# EAGLE board Precision Singleboard Charlieplex (EAGLE 6.1), part 1 of 2
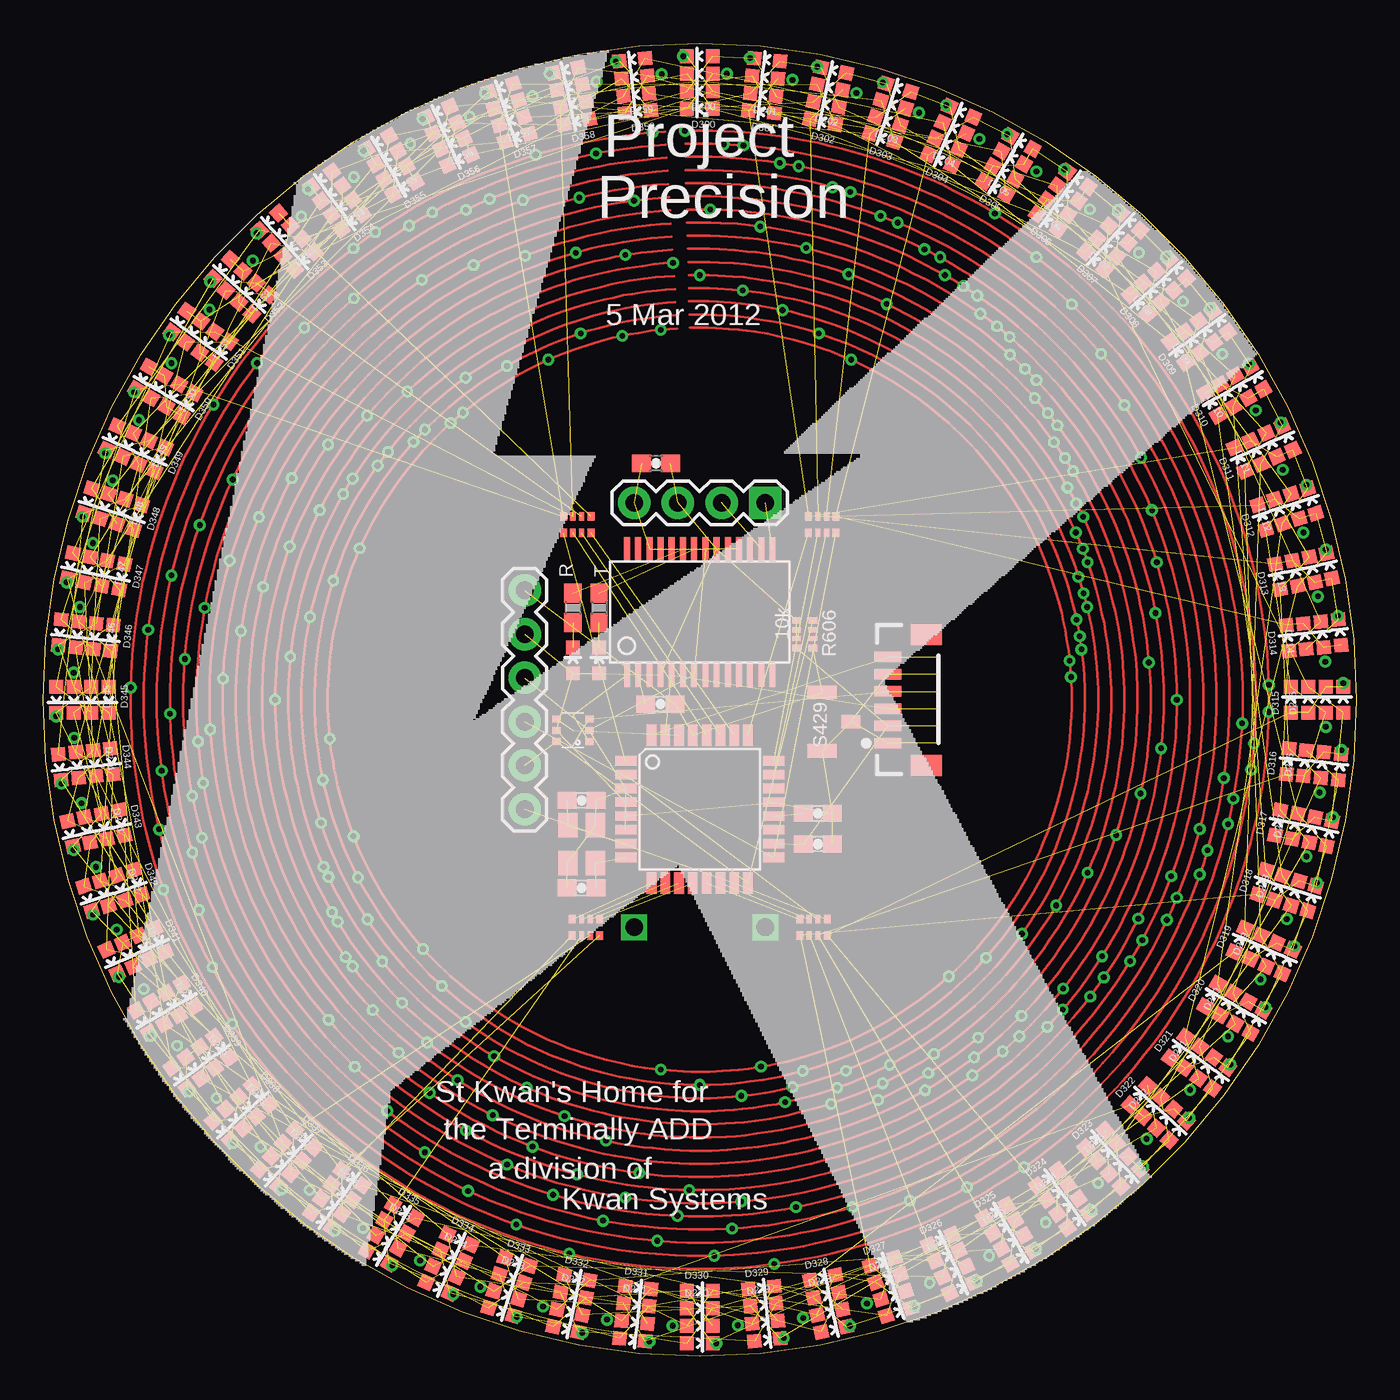
[diagram p2: board, top side]
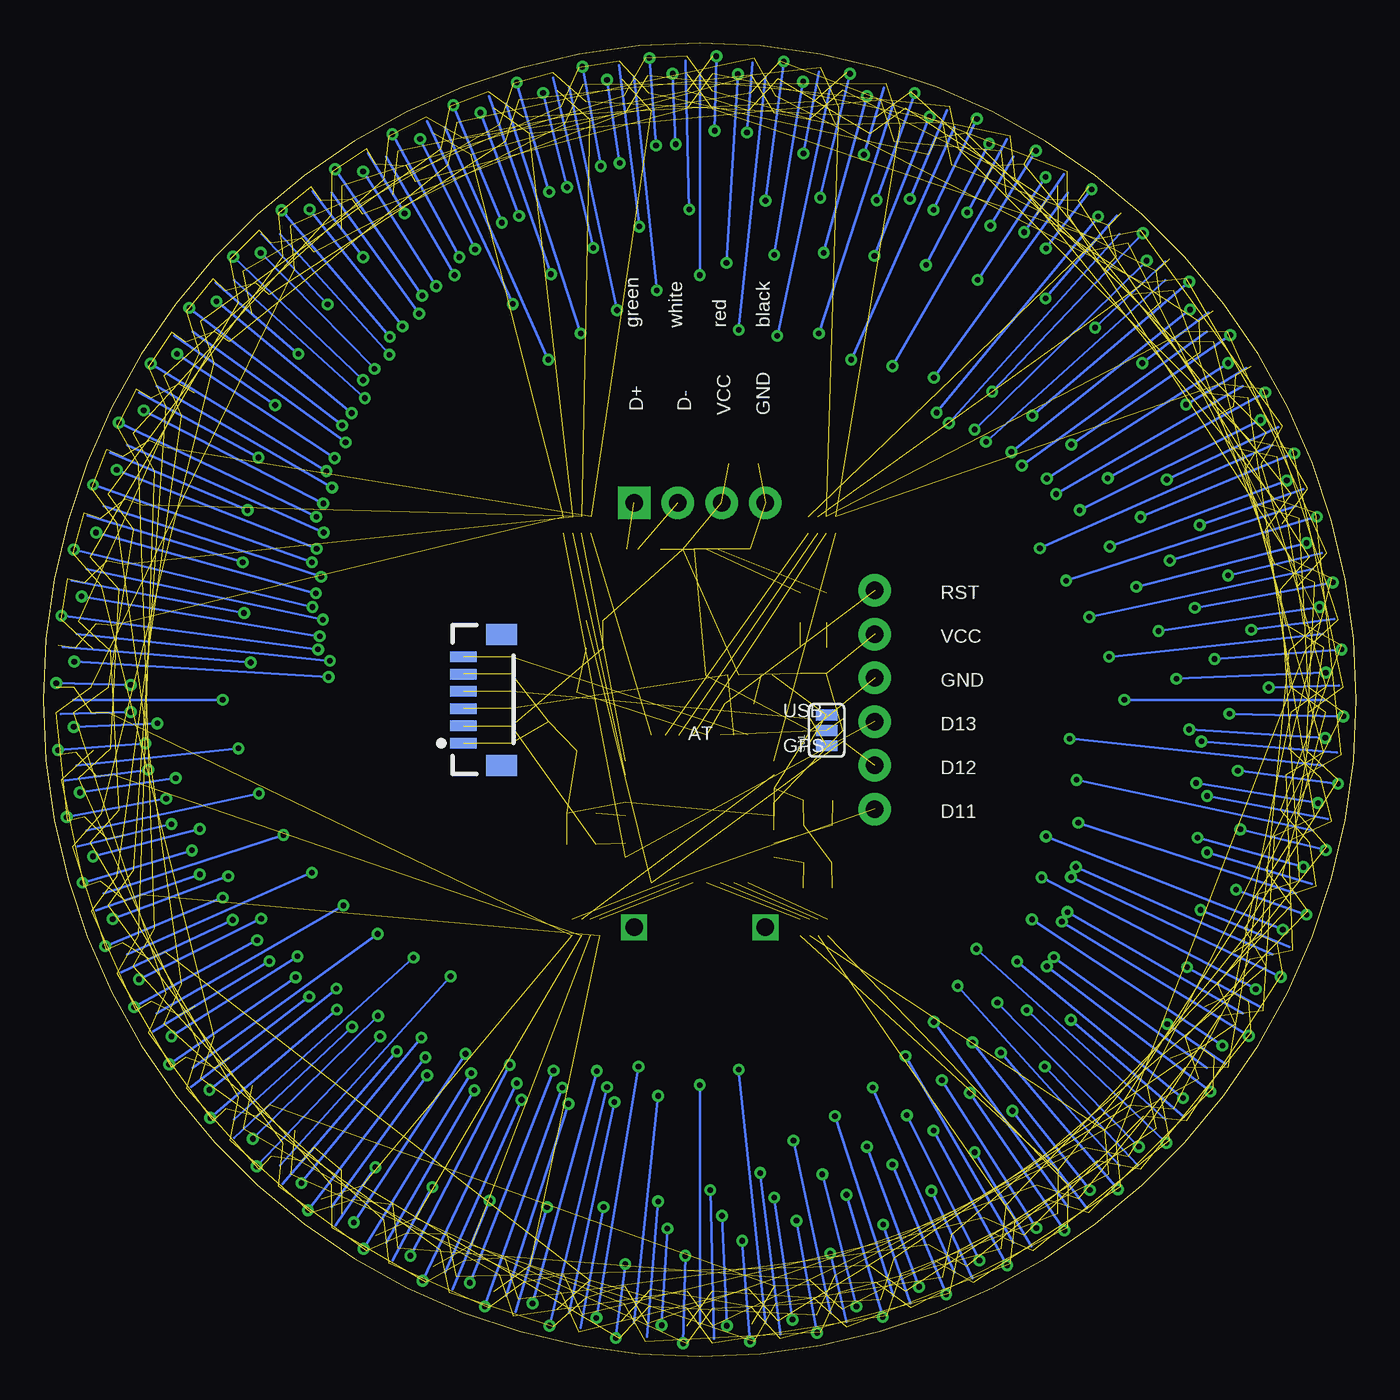
[diagram p3: board, bottom side, seen from below]

Size 76.2 x 76.2 mm. Coordinates in mm from the lower left corner, seen from the top.
Outline: 38.1,76.2 arc-90 76.2,38.1 arc-90 38.1,0 arc-90 0,38.1 arc-90 38.1,76.2
Copper layers (1*16): Top 0.0356mm / dielectric 1.5011mm / Bottom 0.0356mm
Design rules: minimum track width 6mil, minimum drill 13mil, track to track 6mil, track to pad 6mil, pad to pad 6mil, via to via 6mil, smd to smd 6mil, copper to edge 15mil, drill to drill 20mil, minimum pad ring 7mil, minimum via ring 7mil, stop-mask expansion 4mil, vias tented up to drill 14mil, thermal gap 10mil
Net classes: 0 default: width 0.152 mm, drill 0.33 mm, clearance 0.152 mm; 1 power: width 0.152 mm, drill 0.33 mm, clearance 0.152 mm

## Footprints (pad centres in the part's own frame; a part is rotated, then mirrored left to right if it is on the bottom)
0603-CAP = smd 1.1 x 1: 1 -0.85,0; 2 0.85,0
LED-0603 = smd 0.8 x 0.8: A 0,-0.75; C 0,0.75
1X04 = drill 1.016 pad 1.88 square: 1 0,0 | drill 1.016 pad 1.88: 2 2.54,0; 3 5.08,0; 4 7.62,0
1X06 = drill 1.016 pad 1.88: 1 0,0; 2 2.54,0; 3 5.08,0; 4 7.62,0; 5 10.16,0; 6 12.7,0
EM406 = smd 0.6 x 1.55: 1 0,0; 2 1,0; 3 2,0; 4 3,0; 5 4,0; 6 5,0 | smd 1.2 x 1.8: P$1 -1.3,-2.225; P$2 6.3,-2.225
CRA04 = smd 0.4 x 0.5: 1 -0.8,-0.475; 4 0.8,-0.475; 5 0.8,0.475; 8 -0.8,0.475 | smd 0.3 x 0.5: 2 -0.25,-0.475; 3 0.25,-0.475; 6 0.25,0.475; 7 -0.25,0.475
0603-RES = smd 1.1 x 1: 1 -0.85,0; 2 0.85,0
B3U-1100P = smd 0.8 x 1.7: P$1 -1.7,0; P$2 1.7,0 | smd 0.8 x 1.1: P$3 0,-1.65
SJ_3 = smd 0.635 x 1.27: 1 -0.889,0; 2 0,0; 3 0.889,0
TQFP32-08 = smd 1.27 x 0.559: 1 -4.293,2.8; 2 -4.293,2; 3 -4.293,1.2; 4 -4.293,0.4; 5 -4.293,-0.4; 6 -4.293,-1.2; 7 -4.293,-2; 8 -4.293,-2.8; 17 4.293,-2.8; 18 4.293,-2; 19 4.293,-1.2; 20 4.293,-0.4; 21 4.293,0.4; 22 4.293,1.2; 23 4.293,2; 24 4.293,2.8 | smd 0.559 x 1.27: 9 -2.8,-4.293; 10 -2,-4.293; 11 -1.2,-4.293; 12 -0.4,-4.293; 13 0.4,-4.293; 14 1.2,-4.293; 15 2,-4.293; 16 2.8,-4.293; 25 2.8,4.293; 26 2,4.293; 27 1.2,4.293; 28 0.4,4.293; 29 -0.4,4.293; 30 -1.2,4.293; 31 -2,4.293; 32 -2.8,4.293
SSOP28DB = smd 0.348 x 1.397: 1 -4.225,-3.656; 2 -3.575,-3.656; 3 -2.925,-3.656; 4 -2.275,-3.656; 5 -1.625,-3.656; 6 -0.975,-3.656; 7 -0.325,-3.656; 8 0.325,-3.656; 9 0.975,-3.656; 10 1.625,-3.656; 11 2.275,-3.656; 12 2.925,-3.656; 13 3.575,-3.656; 14 4.225,-3.656; 15 4.225,3.656; 16 3.575,3.656; 17 2.925,3.656; 18 2.275,3.656; 19 1.625,3.656; 20 0.975,3.656; 21 0.325,3.656; 22 -0.325,3.656; 23 -0.975,3.656; 24 -1.625,3.656; 25 -2.275,3.656; 26 -2.925,3.656; 27 -3.575,3.656; 28 -4.225,3.656
SC-70-6 = smd 0.4 x 0.5: 1 -0.65,-0.95; 2 0,-0.95; 3 0.65,-0.95; 4 0.65,0.95; 5 0,0.95; 6 -0.65,0.95
CRYSTAL_SMD = smd 1.4 x 1.15: 1 -1.1,-0.8; 2 1.1,-0.8; 3 1.1,0.8; 4 -1.1,0.8

## Placement (x,y rotation side)
C010  4.7uF  [0603-CAP]  35.56,51.82 180 top
C407  18pF  [0603-CAP]  31.24,32.26 180 top
C408  18pF  [0603-CAP]  31.24,27.18 0 top
C418  4.7uF  [0603-CAP]  44.96,29.72 180 top
C420  100nF  [0603-CAP]  44.96,31.5 0 top
C502  100nF  [0603-CAP]  35.81,37.85 180 top
D000  HOUR  [LED-0603]  38.1,75.44 90 top
D001  HOUR  [LED-0603]  42.01,75.23 84 top
D002  HOUR  [LED-0603]  45.87,74.63 78 top
D003  HOUR  [LED-0603]  49.63,73.61 72 top
D004  HOUR  [LED-0603]  53.29,72.21 66 top
D005  HOUR  [LED-0603]  56.77,70.43 60 top
D006  HOUR  [LED-0603]  60.05,68.3 54 top
D007  HOUR  [LED-0603]  63.09,65.84 48 top
D008  HOUR  [LED-0603]  65.84,63.09 42 top
D009  HOUR  [LED-0603]  68.3,60.05 36 top
D010  HOUR  [LED-0603]  70.43,56.77 30 top
D011  HOUR  [LED-0603]  72.21,53.29 24 top
D012  HOUR  [LED-0603]  73.61,49.63 18 top
D013  HOUR  [LED-0603]  74.63,45.87 12 top
D014  HOUR  [LED-0603]  75.23,42.01 6 top
D015  HOUR  [LED-0603]  75.44,38.1 0 top
D016  HOUR  [LED-0603]  75.23,34.19 354 top
D017  HOUR  [LED-0603]  74.63,30.33 348 top
D018  HOUR  [LED-0603]  73.61,26.57 342 top
D019  HOUR  [LED-0603]  72.21,22.91 336 top
D020  HOUR  [LED-0603]  70.43,19.43 330 top
D021  HOUR  [LED-0603]  68.3,16.15 324 top
D022  HOUR  [LED-0603]  65.84,13.11 318 top
D023  HOUR  [LED-0603]  63.09,10.36 312 top
D024  HOUR  [LED-0603]  60.05,7.9 306 top
D025  HOUR  [LED-0603]  56.77,5.77 300 top
D026  HOUR  [LED-0603]  53.29,3.99 294 top
D027  HOUR  [LED-0603]  49.63,2.59 288 top
D028  HOUR  [LED-0603]  45.87,1.57 282 top
D029  HOUR  [LED-0603]  42.01,0.97 276 top
D030  HOUR  [LED-0603]  38.1,0.76 270 top
D031  HOUR  [LED-0603]  34.19,0.97 264 top
D032  HOUR  [LED-0603]  30.33,1.57 258 top
D033  HOUR  [LED-0603]  26.57,2.59 252 top
D034  HOUR  [LED-0603]  22.91,3.99 246 top
D035  HOUR  [LED-0603]  19.43,5.77 240 top
D036  HOUR  [LED-0603]  16.15,7.9 234 top
D037  HOUR  [LED-0603]  13.11,10.36 228 top
D038  HOUR  [LED-0603]  10.36,13.11 222 top
D039  HOUR  [LED-0603]  7.9,16.15 216 top
D040  HOUR  [LED-0603]  5.77,19.43 210 top
D041  HOUR  [LED-0603]  3.99,22.91 204 top
D042  HOUR  [LED-0603]  2.59,26.57 198 top
D043  HOUR  [LED-0603]  1.57,30.33 192 top
D044  HOUR  [LED-0603]  0.97,34.19 186 top
D045  HOUR  [LED-0603]  0.76,38.1 180 top
D046  HOUR  [LED-0603]  0.97,42.01 174 top
D047  HOUR  [LED-0603]  1.57,45.87 168 top
D048  HOUR  [LED-0603]  2.59,49.63 162 top
D049  HOUR  [LED-0603]  3.99,53.29 156 top
D050  HOUR  [LED-0603]  5.77,56.77 150 top
D051  HOUR  [LED-0603]  7.9,60.05 144 top
D052  HOUR  [LED-0603]  10.36,63.09 138 top
D053  HOUR  [LED-0603]  13.11,65.84 132 top
D054  HOUR  [LED-0603]  16.15,68.3 126 top
D055  HOUR  [LED-0603]  19.43,70.43 120 top
D056  HOUR  [LED-0603]  22.91,72.21 114 top
D057  HOUR  [LED-0603]  26.57,73.61 108 top
D058  HOUR  [LED-0603]  30.33,74.63 102 top
D059  HOUR  [LED-0603]  34.19,75.23 96 top
D100  HOUR  [LED-0603]  38.1,74.42 90 top
D101  HOUR  [LED-0603]  41.88,74.22 84 top
D102  HOUR  [LED-0603]  45.64,73.63 78 top
D103  HOUR  [LED-0603]  49.33,72.64 72 top
D104  HOUR  [LED-0603]  52.88,71.27 66 top
D105  HOUR  [LED-0603]  56.26,69.55 60 top
D106  HOUR  [LED-0603]  59.46,67.49 54 top
D107  HOUR  [LED-0603]  62.41,65.1 48 top
D108  HOUR  [LED-0603]  65.1,62.41 42 top
D109  HOUR  [LED-0603]  67.49,59.46 36 top
D110  HOUR  [LED-0603]  69.55,56.26 30 top
D111  HOUR  [LED-0603]  71.27,52.88 24 top
D112  HOUR  [LED-0603]  72.64,49.33 18 top
D113  HOUR  [LED-0603]  73.63,45.64 12 top
D114  HOUR  [LED-0603]  74.22,41.88 6 top
D115  HOUR  [LED-0603]  74.42,38.1 0 top
D116  HOUR  [LED-0603]  74.22,34.32 354 top
D117  HOUR  [LED-0603]  73.63,30.56 348 top
D118  HOUR  [LED-0603]  72.64,26.87 342 top
D119  HOUR  [LED-0603]  71.27,23.32 336 top
D120  HOUR  [LED-0603]  69.55,19.94 330 top
D121  HOUR  [LED-0603]  67.49,16.74 324 top
D122  HOUR  [LED-0603]  65.1,13.79 318 top
D123  HOUR  [LED-0603]  62.41,11.1 312 top
D124  HOUR  [LED-0603]  59.46,8.71 306 top
D125  HOUR  [LED-0603]  56.26,6.65 300 top
D126  HOUR  [LED-0603]  52.88,4.93 294 top
D127  HOUR  [LED-0603]  49.33,3.56 288 top
D128  HOUR  [LED-0603]  45.64,2.57 282 top
D129  HOUR  [LED-0603]  41.88,1.98 276 top
D130  HOUR  [LED-0603]  38.1,1.78 270 top
D131  HOUR  [LED-0603]  34.32,1.98 264 top
D132  HOUR  [LED-0603]  30.56,2.57 258 top
D133  HOUR  [LED-0603]  26.87,3.56 252 top
D134  HOUR  [LED-0603]  23.32,4.93 246 top
D135  HOUR  [LED-0603]  19.94,6.65 240 top
D136  HOUR  [LED-0603]  16.74,8.71 234 top
D137  HOUR  [LED-0603]  13.79,11.1 228 top
D138  HOUR  [LED-0603]  11.1,13.79 222 top
D139  HOUR  [LED-0603]  8.71,16.74 216 top
D140  HOUR  [LED-0603]  6.65,19.94 210 top
D141  HOUR  [LED-0603]  4.93,23.32 204 top
D142  HOUR  [LED-0603]  3.56,26.87 198 top
D143  HOUR  [LED-0603]  2.57,30.56 192 top
D144  HOUR  [LED-0603]  1.98,34.32 186 top
D145  HOUR  [LED-0603]  1.78,38.1 180 top
D146  HOUR  [LED-0603]  1.98,41.88 174 top
D147  HOUR  [LED-0603]  2.57,45.64 168 top
D148  HOUR  [LED-0603]  3.56,49.33 162 top
D149  HOUR  [LED-0603]  4.93,52.88 156 top
D150  HOUR  [LED-0603]  6.65,56.26 150 top
D151  HOUR  [LED-0603]  8.71,59.46 144 top
D152  HOUR  [LED-0603]  11.1,62.41 138 top
D153  HOUR  [LED-0603]  13.79,65.1 132 top
D154  HOUR  [LED-0603]  16.74,67.49 126 top
D155  HOUR  [LED-0603]  19.94,69.55 120 top
D156  HOUR  [LED-0603]  23.32,71.27 114 top
D157  HOUR  [LED-0603]  26.87,72.64 108 top
D158  HOUR  [LED-0603]  30.56,73.63 102 top
D159  HOUR  [LED-0603]  34.32,74.22 96 top
D200  HOUR  [LED-0603]  38.1,73.41 90 top
D201  HOUR  [LED-0603]  41.78,73.2 84 top
D202  HOUR  [LED-0603]  45.44,72.64 78 top
D203  HOUR  [LED-0603]  49.02,71.68 72 top
D204  HOUR  [LED-0603]  52.45,70.36 66 top
D205  HOUR  [LED-0603]  55.75,68.68 60 top
D206  HOUR  [LED-0603]  58.85,66.67 54 top
D207  HOUR  [LED-0603]  61.72,64.34 48 top
D208  HOUR  [LED-0603]  64.34,61.72 42 top
D209  HOUR  [LED-0603]  66.67,58.85 36 top
D210  HOUR  [LED-0603]  68.68,55.75 30 top
D211  HOUR  [LED-0603]  70.36,52.45 24 top
D212  HOUR  [LED-0603]  71.68,49.02 18 top
D213  HOUR  [LED-0603]  72.64,45.44 12 top
D214  HOUR  [LED-0603]  73.2,41.78 6 top
D215  HOUR  [LED-0603]  73.41,38.1 0 top
D216  HOUR  [LED-0603]  73.2,34.42 354 top
D217  HOUR  [LED-0603]  72.64,30.76 348 top
D218  HOUR  [LED-0603]  71.68,27.18 342 top
D219  HOUR  [LED-0603]  70.36,23.75 336 top
D220  HOUR  [LED-0603]  68.68,20.45 330 top
D221  HOUR  [LED-0603]  66.67,17.35 324 top
D222  HOUR  [LED-0603]  64.34,14.48 318 top
D223  HOUR  [LED-0603]  61.72,11.86 312 top
D224  HOUR  [LED-0603]  58.85,9.53 306 top
D225  HOUR  [LED-0603]  55.75,7.52 300 top
D226  HOUR  [LED-0603]  52.45,5.84 294 top
D227  HOUR  [LED-0603]  49.02,4.52 288 top
D228  HOUR  [LED-0603]  45.44,3.56 282 top
D229  HOUR  [LED-0603]  41.78,3 276 top
D230  HOUR  [LED-0603]  38.1,2.79 270 top
D231  HOUR  [LED-0603]  34.42,3 264 top
D232  HOUR  [LED-0603]  30.76,3.56 258 top
D233  HOUR  [LED-0603]  27.18,4.52 252 top
D234  HOUR  [LED-0603]  23.75,5.84 246 top
D235  HOUR  [LED-0603]  20.45,7.52 240 top
D236  HOUR  [LED-0603]  17.35,9.53 234 top
D237  HOUR  [LED-0603]  14.48,11.86 228 top
D238  HOUR  [LED-0603]  11.86,14.48 222 top
D239  HOUR  [LED-0603]  9.53,17.35 216 top
D240  HOUR  [LED-0603]  7.52,20.45 210 top
D241  HOUR  [LED-0603]  5.84,23.75 204 top
D242  HOUR  [LED-0603]  4.52,27.18 198 top
D243  HOUR  [LED-0603]  3.56,30.76 192 top
D244  HOUR  [LED-0603]  3,34.42 186 top
D245  HOUR  [LED-0603]  2.79,38.1 180 top
D246  HOUR  [LED-0603]  3,41.78 174 top
D247  HOUR  [LED-0603]  3.56,45.44 168 top
D248  HOUR  [LED-0603]  4.52,49.02 162 top
D249  HOUR  [LED-0603]  5.84,52.45 156 top
D250  HOUR  [LED-0603]  7.52,55.75 150 top
D251  HOUR  [LED-0603]  9.53,58.85 144 top
D252  HOUR  [LED-0603]  11.86,61.72 138 top
D253  HOUR  [LED-0603]  14.48,64.34 132 top
D254  HOUR  [LED-0603]  17.35,66.67 126 top
D255  HOUR  [LED-0603]  20.45,68.68 120 top
D256  HOUR  [LED-0603]  23.75,70.36 114 top
D257  HOUR  [LED-0603]  27.18,71.68 108 top
D258  HOUR  [LED-0603]  30.76,72.64 102 top
D259  HOUR  [LED-0603]  34.42,73.2 96 top
D300  HOUR  [LED-0603]  38.1,72.39 90 top
D301  HOUR  [LED-0603]  41.68,72.21 84 top
D302  HOUR  [LED-0603]  45.24,71.63 78 top
D303  HOUR  [LED-0603]  48.69,70.71 72 top
D304  HOUR  [LED-0603]  52.04,69.42 66 top
D305  HOUR  [LED-0603]  55.24,67.79 60 top
D306  HOUR  [LED-0603]  58.27,65.84 54 top
D307  HOUR  [LED-0603]  61.04,63.58 48 top
D308  HOUR  [LED-0603]  63.58,61.04 42 top
D309  HOUR  [LED-0603]  65.84,58.27 36 top
D310  HOUR  [LED-0603]  67.79,55.24 30 top
D311  HOUR  [LED-0603]  69.42,52.04 24 top
D312  HOUR  [LED-0603]  70.71,48.69 18 top
D313  HOUR  [LED-0603]  71.63,45.24 12 top
D314  HOUR  [LED-0603]  72.21,41.68 6 top
D315  HOUR  [LED-0603]  72.39,38.1 0 top
D316  HOUR  [LED-0603]  72.21,34.52 354 top
D317  HOUR  [LED-0603]  71.63,30.96 348 top
D318  HOUR  [LED-0603]  70.71,27.51 342 top
D319  HOUR  [LED-0603]  69.42,24.16 336 top
D320  HOUR  [LED-0603]  67.79,20.95 330 top
D321  HOUR  [LED-0603]  65.84,17.93 324 top
D322  HOUR  [LED-0603]  63.58,15.16 318 top
D323  HOUR  [LED-0603]  61.04,12.62 312 top
D324  HOUR  [LED-0603]  58.27,10.36 306 top
D325  HOUR  [LED-0603]  55.24,8.41 300 top
D326  HOUR  [LED-0603]  52.04,6.78 294 top
D327  HOUR  [LED-0603]  48.69,5.49 288 top
D328  HOUR  [LED-0603]  45.24,4.57 282 top
D329  HOUR  [LED-0603]  41.68,3.99 276 top
D330  HOUR  [LED-0603]  38.1,3.81 270 top
D331  HOUR  [LED-0603]  34.52,3.99 264 top
D332  HOUR  [LED-0603]  30.96,4.57 258 top
D333  HOUR  [LED-0603]  27.51,5.49 252 top
D334  HOUR  [LED-0603]  24.16,6.78 246 top
D335  HOUR  [LED-0603]  20.95,8.41 240 top
D336  HOUR  [LED-0603]  17.93,10.36 234 top
D337  HOUR  [LED-0603]  15.16,12.62 228 top
D338  HOUR  [LED-0603]  12.62,15.16 222 top
D339  HOUR  [LED-0603]  10.36,17.93 216 top
D340  HOUR  [LED-0603]  8.41,20.95 210 top
D341  HOUR  [LED-0603]  6.78,24.16 204 top
D342  HOUR  [LED-0603]  5.49,27.51 198 top
D343  HOUR  [LED-0603]  4.57,30.96 192 top
D344  HOUR  [LED-0603]  3.99,34.52 186 top
D345  HOUR  [LED-0603]  3.81,38.1 180 top
D346  HOUR  [LED-0603]  3.99,41.68 174 top
D347  HOUR  [LED-0603]  4.57,45.24 168 top
D348  HOUR  [LED-0603]  5.49,48.69 162 top
D349  HOUR  [LED-0603]  6.78,52.04 156 top
D350  HOUR  [LED-0603]  8.41,55.24 150 top
D351  HOUR  [LED-0603]  10.36,58.27 144 top
D352  HOUR  [LED-0603]  12.62,61.04 138 top
D353  HOUR  [LED-0603]  15.16,63.58 132 top
D354  HOUR  [LED-0603]  17.93,65.84 126 top
D355  HOUR  [LED-0603]  20.95,67.79 120 top
D356  HOUR  [LED-0603]  24.16,69.42 114 top
D357  HOUR  [LED-0603]  27.51,70.71 108 top
D358  HOUR  [LED-0603]  30.96,71.63 102 top
D359  HOUR  [LED-0603]  34.52,72.21 96 top
D501  RED  [LED-0603]  30.73,40.39 0 top
D502  BLUE  [LED-0603]  32.26,40.39 0 top
J002  [1X04]  41.91,49.53 180 top
J003  [1X06]  27.94,44.45 270 top
J402  EM406  [EM406]  51.82,35.59 90 bottom
J404  EM406  [EM406]  49.02,35.59 90 top
R1  47  [CRA04]  44.7,24.89 180 top
R2  47  [CRA04]  31.5,24.89 180 top
R3  47  [CRA04]  30.99,48.26 0 top
R4  47  [CRA04]  45.21,48.26 0 top
R501  680  [0603-RES]  30.73,43.43 270 top
R502  680  [0603-RES]  32.26,43.43 270 top
R606  10k  [CRA04]  44.2,41.91 270 top
S429  B3U-1100P  [B3U-1100P]  45.21,36.83 90 top
SJ1  [SJ_3]  30.73,36.32 90 bottom
U401  ATMEGA328  [TQFP32-08]  38.1,31.75 0 top
U501  FT232RLSSOP  [SSOP28DB]  38.1,43.18 0 top
U602  ZF7  [SC-70-6]  30.73,36.32 90 top
Y401  12.00  [CRYSTAL_SMD]  31.24,29.72 270 top

## Tracks (layer width: path | path; a pad name or v marks a point on that pad's centre or on a via)
AREF  (1 unrouted)
AT_RX  (2 unrouted)
AT_TX  (3 unrouted)
D12  (3 unrouted)
GND  (23 unrouted)
GPS_TX  (3 unrouted)
N$3  (1 unrouted)
N$5  (1 unrouted)
N$6  (1 unrouted)
N$7  (1 unrouted)
N$8  (1 unrouted)
N$106  (via drill 1.02)
  other vias: 34.29,24.89
N$907  (via drill 1.02)
  other vias: 41.91,24.89
P01  (2 unrouted)
P02  (1 unrouted)
P03  (1 unrouted)
P04  (1 unrouted)
P05  (1 unrouted)
P06  (1 unrouted)
P07  (1 unrouted)
P08  (1 unrouted)
P09  (1 unrouted)
P10  (1 unrouted)
P11  (1 unrouted)
P12  (1 unrouted)
P13  (1 unrouted)
P14  (1 unrouted)
P15  (1 unrouted)
P16  (2 unrouted)
PPS  (2 unrouted)
Q01  (via drill 0.33)  (30 unrouted)
  Top 0.152: v37.24,71.12 38.81,71.12 39.55,71.09 40.69,71.02 41.55,70.94 42.27,70.87 42.98,70.76 44.12,70.56 44.96,70.41 45.67,70.23 46.35,70.08 47.47,69.75 48.31,69.49 49,69.27 49.66,69.04 50.72,68.61 51.54,68.28 52.2,67.97 52.83,67.64 53.85,67.11 54.61,66.7 v55.22,66.32 55.83,65.94 56.79,65.3 57.51,64.82 58.09,64.39 58.65,63.93 59.54,63.22 60.2,62.64 60.73,62.15 62.05,60.83 62.64,60.2 63.12,59.66 63.58,59.11 64.82,57.51 65.63,56.34 66.24,55.35 66.7,54.61 67.06,53.98 67.39,53.34 67.89,52.32 68.28,51.54 68.56,50.88 68.83,50.19 69.22,49.12 69.49,48.31 69.72,47.62 69.93,46.91 70.21,45.8 70.41,44.96 70.54,44.25 70.66,43.56 70.84,42.42 70.94,41.55 71.02,40.84 71.07,40.11 v71.12,38.96 v71.12,37.39 71.09,36.65 71.02,35.51 70.94,34.65 70.87,33.93 70.76,33.22 70.56,32.08 70.41,31.24 70.23,30.53 70.08,29.84 69.75,28.73 69.49,27.89 69.27,27.2 69.04,26.54 68.61,25.48 68.28,24.66 67.97,24 67.64,23.37 67.11,22.35 66.7,21.59 65.94,20.37 65.3,19.41 64.82,18.69 64.39,18.11 63.93,17.55 63.22,16.66 62.64,16 62.15,15.47 60.83,14.15 60.2,13.56 59.66,13.08 59.11,12.62 57.51,11.38 v56.92,10.97 56.34,10.57 55.35,9.96 54.61,9.5 53.98,9.14 53.34,8.81 52.32,8.31 51.54,7.92 50.88,7.64 50.19,7.37 49.12,6.99 48.31,6.71 47.62,6.48 46.91,6.27 45.8,5.99 44.96,5.79 44.25,5.66 43.56,5.54 v42.42,5.36 41.55,5.26 40.84,5.18 40.11,5.13 38.96,5.08 37.39,5.08 36.65,5.11 35.51,5.18 34.65,5.26 33.93,5.33 33.22,5.44 32.08,5.64 31.24,5.79 v30.53,5.97 29.84,6.12 28.73,6.45 27.89,6.71 27.2,6.93 26.54,7.16 25.48,7.59 24.66,7.92 24,8.23 23.37,8.56 22.35,9.09 21.59,9.5 20.37,10.26 19.41,10.9 18.69,11.38 18.11,11.81 17.55,12.27 16.66,12.98 16,13.56 15.47,14.05 14.15,15.37 13.56,16 13.08,16.54 12.62,17.09 11.38,18.69 v10.97,19.28 10.57,19.86 9.96,20.85 9.5,21.59 9.14,22.23 8.81,22.86 8.31,23.88 7.92,24.66 7.64,25.32 7.37,26.01 v6.99,27.08 6.71,27.89 6.48,28.57 6.27,29.29 5.99,30.4 5.79,31.24 5.66,31.95 5.54,32.64 5.36,33.78 5.26,34.65 5.18,35.36 5.13,36.09 5.08,37.24 v5.08,38.81 5.11,39.55 5.18,40.69 5.26,41.55 5.33,42.27 5.44,42.98 5.64,44.12 5.79,44.96 5.97,45.67 6.12,46.35 6.45,47.47 6.71,48.31 6.93,49 7.16,49.66 7.59,50.72 7.92,51.54 8.23,52.2 8.56,52.83 9.09,53.85 9.5,54.61 v9.88,55.22 10.26,55.83 10.9,56.79 11.38,57.51 11.81,58.09 12.27,58.65 12.98,59.54 13.56,60.2 14.05,60.73 15.37,62.05 16,62.64 16.54,63.12 17.09,63.58 v18.01,64.29 18.69,64.82 v19.28,65.23 19.86,65.63 20.85,66.24 21.59,66.7 22.23,67.06 22.86,67.39 23.88,67.89 24.66,68.28 25.32,68.56 26.01,68.83 27.08,69.22 27.89,69.49 v28.57,69.72 29.29,69.93 30.4,70.21 31.24,70.41 31.95,70.54 32.64,70.66 33.78,70.84 34.65,70.94 v35.36,71.02 36.09,71.07
  Bottom 0.152: v37.13,75.44 v37.24,71.12 | v75.44,39.06 v71.12,38.96 | v42.98,1.07 v42.42,5.36 | v2.9,25.63 v6.99,27.08 | v15.37,67.72 v18.01,64.29 | 57.35,69.8 v55.22,66.32 | 75.18,37.29 v71.12,37.39 | 59.23,7.62 v56.92,10.97 | 29.59,2.01 v30.53,5.97 | 7.62,16.97 v10.97,19.28 | 1.02,38.91 v5.08,38.81 | 6.4,57.35 v9.88,55.22 | 16.97,68.58 v19.28,65.23 | 27.41,73.61 v28.57,69.72 | 35.03,75.06 v35.36,71.02
Q02  (via drill 0.33)  (30 unrouted)
  Top 0.152: 37.26,70.36 38.81,70.36 v39.5,70.33 v40.64,70.26 41.48,70.18 42.16,70.1 42.88,70 43.97,69.83 44.81,69.65 46.18,69.34 47.27,69.04 48.06,68.78 48.74,68.56 49.4,68.33 50.44,67.89 51.23,67.56 51.87,67.28 52.5,66.98 53.49,66.45 54.23,66.04 54.84,65.68 55.42,65.3 56.36,64.69 57.05,64.19 v57.63,63.78 58.19,63.35 59.05,62.64 59.69,62.08 60.71,61.11 61.49,60.3 62.08,59.69 62.99,58.62 63.7,57.73 64.19,57.05 64.59,56.49 65,55.91 65.61,54.97 66.04,54.23 66.37,53.62 66.73,52.98 67.21,51.99 67.56,51.23 68.12,49.91 68.5,48.87 68.78,48.06 68.99,47.4 69.19,46.71 69.47,45.62 69.65,44.81 69.8,44.12 69.93,43.43 70.08,42.32 70.18,41.48 70.26,40.77 70.31,40.08 70.36,38.94 70.36,37.39 70.33,36.7 v70.26,35.56 70.18,34.72 v70.1,34.04 70,33.33 69.83,32.23 69.65,31.39 69.34,30.02 69.04,28.93 68.78,28.14 68.56,27.46 68.33,26.8 67.89,25.76 67.56,24.97 67.28,24.33 66.98,23.7 66.45,22.71 66.04,21.97 65.68,21.36 65.3,20.78 64.69,19.84 64.19,19.15 63.78,18.57 63.35,18.01 62.64,17.14 62.08,16.51 61.11,15.49 60.3,14.71 59.69,14.12 58.62,13.21 57.73,12.5 57.05,12.01 56.49,11.61 55.91,11.2 54.97,10.59 54.23,10.16 v53.62,9.83 52.98,9.47 51.99,8.99 51.23,8.64 49.91,8.08 48.87,7.7 48.06,7.42 47.4,7.21 46.71,7.01 45.62,6.73 44.81,6.55 44.12,6.4 43.43,6.27 42.32,6.12 41.48,6.02 40.77,5.94 40.08,5.89 v38.94,5.84 37.39,5.84 36.7,5.87 35.56,5.94 34.72,6.02 34.04,6.1 33.33,6.2 32.23,6.38 31.39,6.55 30.02,6.86 28.93,7.16 28.14,7.42 v27.46,7.64 26.8,7.87 25.76,8.31 24.97,8.64 24.33,8.91 23.7,9.22 22.71,9.75 21.97,10.16 21.36,10.52 20.78,10.9 19.84,11.51 19.15,12.01 18.57,12.42 18.01,12.85 17.14,13.56 16.51,14.12 15.49,15.09 14.71,15.9 14.12,16.51 13.21,17.58 12.5,18.47 12.01,19.15 11.61,19.71 11.2,20.3 10.59,21.23 10.16,21.97 v9.83,22.58 9.47,23.22 8.99,24.21 8.64,24.97 8.08,26.29 7.7,27.33 7.42,28.14 7.21,28.8 7.01,29.49 v6.73,30.58 6.55,31.39 6.4,32.08 6.27,32.77 6.12,33.88 6.02,34.72 5.94,35.43 5.89,36.12 5.84,37.26 5.84,38.81 5.87,39.5 5.94,40.64 6.02,41.48 v6.1,42.16 6.2,42.88 6.38,43.97 6.55,44.81 6.86,46.18 7.16,47.27 7.42,48.06 7.64,48.74 7.87,49.4 8.31,50.44 8.64,51.23 8.91,51.87 9.22,52.5 9.75,53.49 10.16,54.23 10.52,54.84 10.9,55.42 11.51,56.36 12.01,57.05 v12.42,57.63 12.85,58.19 13.56,59.05 14.12,59.69 15.09,60.71 15.9,61.49 16.51,62.08 17.58,62.99 18.47,63.7 19.15,64.19 19.71,64.59 20.3,65 v21.23,65.61 21.97,66.04 v22.58,66.37 23.22,66.73 24.21,67.21 24.97,67.56 26.29,68.12 27.33,68.5 28.14,68.78 28.8,68.99 29.49,69.19 30.58,69.47 31.39,69.65 v32.08,69.8 32.77,69.93 33.88,70.08 34.72,70.18 35.43,70.26 36.12,70.31
  Bottom 0.152: v39.67,74.42 v39.5,70.33 | v41.02,75.34 v40.64,70.26 | v75.34,35.18 v70.26,35.56 | v39.06,0.76 v38.94,5.84 | v1.78,29.39 v6.73,30.58 | v18.59,69.95 v21.23,65.61 | 60.55,67.61 v57.63,63.78 | 74.91,33.43 v70.1,34.04 | 55.93,5.59 v53.62,9.83 | 25.88,3.07 v27.46,7.64 | 5.59,20.27 v9.83,22.58 | 1.29,42.77 v6.1,42.16 | 8.59,60.55 v12.42,57.63 | 20.27,70.61 v22.58,66.37 | 31.19,74.55 v32.08,69.8
Q03  (via drill 0.33)  (30 unrouted)
  Top 0.152: 37.29,69.6 38.79,69.6 39.47,69.57 40.56,69.49 41.4,69.42 42.06,69.34 v42.75,69.24 v43.84,69.06 44.65,68.91 45.97,68.61 47.04,68.3 47.83,68.05 48.49,67.84 49.12,67.59 50.16,67.21 50.9,66.88 51.54,66.6 52.15,66.29 53.14,65.79 53.85,65.38 55.02,64.67 55.93,64.06 56.62,63.58 57.17,63.17 57.71,62.74 58.55,62.05 59.18,61.49 v59.69,61.04 60.94,59.79 61.49,59.18 61.95,58.65 62.41,58.14 63.09,57.28 63.58,56.62 63.98,56.06 64.36,55.47 64.95,54.56 65.38,53.85 65.71,53.24 66.04,52.65 66.52,51.66 66.88,50.9 67.16,50.29 67.41,49.63 67.79,48.62 68.05,47.83 68.45,46.51 68.73,45.44 68.91,44.65 69.04,43.97 69.16,43.31 69.32,42.22 69.42,41.4 69.49,40.72 69.55,40.03 69.6,38.91 69.6,37.41 v69.57,36.73 69.49,35.64 69.42,34.8 69.34,34.14 69.24,33.45 v69.06,32.36 68.91,31.55 v68.76,30.89 68.61,30.23 68.3,29.16 68.05,28.37 67.84,27.71 67.59,27.08 67.21,26.04 66.88,25.3 66.6,24.66 66.29,24.05 65.79,23.06 65.38,22.35 64.67,21.18 64.06,20.27 63.58,19.58 63.17,19.02 62.74,18.49 62.05,17.65 61.49,17.02 61.04,16.51 59.79,15.27 59.18,14.71 58.65,14.25 58.14,13.79 57.28,13.11 56.62,12.62 56.06,12.22 55.47,11.84 54.56,11.25 53.85,10.82 53.24,10.49 52.65,10.16 51.66,9.68 50.9,9.32 v50.29,9.04 49.63,8.79 48.62,8.41 47.83,8.15 46.51,7.75 45.44,7.47 44.65,7.29 43.97,7.16 43.31,7.04 42.22,6.88 41.4,6.78 40.72,6.71 40.03,6.66 38.91,6.6 37.41,6.6 36.73,6.63 v35.64,6.71 34.8,6.78 34.14,6.86 33.45,6.96 32.36,7.14 31.55,7.29 30.23,7.59 29.16,7.9 28.37,8.15 27.71,8.36 27.08,8.61 26.04,8.99 25.3,9.32 v24.66,9.6 24.05,9.91 23.06,10.41 22.35,10.82 21.18,11.53 20.27,12.14 19.58,12.62 19.02,13.03 18.49,13.46 17.65,14.15 17.02,14.71 16.51,15.16 15.27,16.41 14.71,17.02 14.25,17.55 13.79,18.06 13.11,18.92 12.62,19.58 12.22,20.14 11.84,20.73 11.25,21.64 10.82,22.35 10.49,22.96 10.16,23.55 9.68,24.54 9.32,25.3 v9.04,25.91 8.79,26.57 8.41,27.58 8.15,28.37 7.75,29.69 7.47,30.76 7.29,31.55 7.16,32.23 7.04,32.89 v6.88,33.98 6.78,34.8 6.71,35.48 6.66,36.17 6.6,37.29 6.6,38.79 6.63,39.47 6.71,40.56 6.78,41.4 6.86,42.06 6.96,42.75 7.14,43.84 7.29,44.65 v7.44,45.31 7.59,45.97 7.9,47.04 8.15,47.83 8.36,48.49 8.61,49.12 8.99,50.16 9.32,50.9 9.6,51.54 9.91,52.15 10.41,53.14 10.82,53.85 11.53,55.02 12.14,55.93 12.62,56.62 13.03,57.17 13.46,57.71 14.15,58.55 14.71,59.18 v15.16,59.69 16.41,60.94 17.02,61.49 17.55,61.95 18.06,62.41 18.92,63.09 19.58,63.58 20.14,63.98 20.73,64.36 21.64,64.95 22.35,65.38 22.96,65.71 23.55,66.04 v24.54,66.52 25.3,66.88 v25.91,67.16 26.57,67.41 27.58,67.79 28.37,68.05 29.69,68.45 30.76,68.73 31.55,68.91 32.23,69.04 32.89,69.16 33.98,69.32 34.8,69.42 35.48,69.49 36.17,69.55
  Bottom 0.152: v43.48,74.07 v42.75,69.24 | v44.91,74.83 v43.84,69.06 | v74.42,36.52 v69.57,36.73 | v74.83,31.29 v69.06,32.36 | v35.18,0.86 v35.64,6.71 | v1.07,33.22 v6.88,33.98 | v22.02,71.81 v24.54,66.52 | 63.52,65.13 v59.69,61.04 | 74.19,29.59 v68.76,30.89 | 52.45,3.89 v50.29,9.04 | 22.28,4.55 v24.66,9.6 | 3.89,23.75 v9.04,25.91 | 2.01,46.61 v7.44,45.31 | 11.07,63.52 v15.16,59.69 | 23.75,72.31 v25.91,67.16
Q04  (via drill 0.33)  (30 unrouted)
  Top 0.152: 37.29,68.83 38.76,68.83 39.45,68.81 40.51,68.73 41.3,68.66 41.99,68.58 42.65,68.5 43.71,68.33 44.5,68.17 45.14,68.02 v45.8,67.84 v46.84,67.56 47.6,67.33 48.87,66.88 49.86,66.5 50.6,66.17 51.82,65.61 52.76,65.1 53.47,64.72 54.05,64.36 54.61,64.03 55.5,63.42 56.16,62.97 57.23,62.15 58.06,61.47 58.67,60.94 59.64,60.02 60.4,59.26 60.94,58.67 v61.39,58.17 61.82,57.66 62.48,56.82 62.97,56.16 63.35,55.63 63.73,55.07 64.31,54.15 64.72,53.47 65.05,52.88 65.35,52.3 65.84,51.33 66.17,50.6 66.45,49.99 66.7,49.35 67.08,48.36 67.33,47.6 67.54,46.97 67.72,46.3 68,45.26 68.17,44.5 68.3,43.84 68.4,43.18 68.58,42.11 68.66,41.3 68.73,40.64 68.78,39.98 68.83,38.91 68.83,37.44 68.81,36.75 68.73,35.69 68.66,34.9 68.58,34.21 v68.5,33.55 68.33,32.49 68.17,31.7 68.02,31.06 67.84,30.4 v67.56,29.36 67.33,28.6 v67.11,27.96 66.88,27.33 66.5,26.34 66.17,25.6 65.61,24.38 65.1,23.44 64.72,22.73 64.36,22.15 64.03,21.59 63.42,20.7 62.97,20.04 62.15,18.97 61.47,18.14 60.94,17.53 60.02,16.56 59.26,15.8 58.67,15.27 58.17,14.81 57.66,14.38 56.82,13.72 56.16,13.23 55.63,12.85 55.07,12.47 54.15,11.89 53.47,11.48 52.88,11.15 52.3,10.85 51.33,10.36 50.6,10.03 49.99,9.75 49.35,9.5 48.36,9.12 47.6,8.87 v46.97,8.66 46.3,8.48 45.26,8.2 44.5,8.03 43.84,7.9 43.18,7.8 42.11,7.62 41.3,7.54 40.64,7.47 v39.98,7.42 38.91,7.37 37.44,7.37 36.75,7.39 35.69,7.47 34.9,7.54 34.21,7.62 33.55,7.7 v32.49,7.87 31.7,8.03 31.06,8.18 30.4,8.36 29.36,8.64 28.6,8.87 27.33,9.32 26.34,9.7 25.6,10.03 24.38,10.59 23.44,11.1 22.73,11.48 v22.15,11.84 21.59,12.17 20.7,12.78 20.04,13.23 18.97,14.05 18.14,14.73 17.53,15.27 16.56,16.18 15.8,16.94 15.27,17.53 14.81,18.03 14.38,18.54 13.72,19.38 13.23,20.04 12.85,20.57 12.47,21.13 11.89,22.05 11.48,22.73 11.15,23.32 10.85,23.9 10.36,24.87 10.03,25.6 9.75,26.21 9.5,26.85 9.12,27.84 8.87,28.6 v8.66,29.23 8.48,29.9 8.2,30.94 8.03,31.7 7.9,32.36 7.8,33.02 7.62,34.09 7.54,34.9 7.47,35.56 7.42,36.22 v7.37,37.29 7.37,38.76 7.39,39.45 7.47,40.51 7.54,41.3 7.62,41.99 7.7,42.65 7.87,43.71 8.03,44.5 8.18,45.14 8.36,45.8 8.64,46.84 8.87,47.6 v9.09,48.23 9.32,48.87 9.7,49.86 10.03,50.6 10.59,51.82 11.1,52.76 11.48,53.47 11.84,54.05 12.17,54.61 12.78,55.5 13.23,56.16 14.05,57.23 14.73,58.06 15.27,58.67 16.18,59.64 16.94,60.4 17.53,60.94 v18.03,61.39 18.54,61.82 19.38,62.48 20.04,62.97 20.57,63.35 21.13,63.73 22.05,64.31 22.73,64.72 23.32,65.05 23.9,65.35 24.87,65.84 25.6,66.17 26.21,66.45 26.85,66.7 v27.84,67.08 28.6,67.33 29.23,67.54 29.9,67.72 30.94,68 31.7,68.17 32.36,68.3 33.02,68.4 34.09,68.58 34.9,68.66 35.56,68.73 36.22,68.78
  Bottom 0.152: v47.19,73.3 v45.8,67.84 | v48.72,73.91 v46.84,67.56 | v74.07,32.72 v68.5,33.55 | v73.91,27.48 v67.56,29.36 | v40.31,1.8 v39.98,7.42 | v31.29,1.37 v32.49,7.87 | v0.76,37.13 v7.37,37.29 | v25.63,73.3 v27.84,67.08 | 66.19,62.31 v61.39,58.17 | 73.13,25.88 v67.11,27.96 | 48.79,2.59 v46.97,8.66 | 18.85,6.4 v22.15,11.84 | 2.59,27.41 v8.66,29.23 | 3.07,50.32 v9.09,48.23 | 13.89,66.19 v18.03,61.39
Q05  (via drill 0.33)  (30 unrouted)
  Top 0.152: 37.31,68.07 38.76,68.07 39.4,68.05 40.46,67.97 41.22,67.92 41.88,67.84 42.52,67.74 43.56,67.56 44.96,67.28 45.59,67.11 46.61,66.83 47.37,66.6 47.98,66.4 v48.59,66.17 v49.58,65.79 50.29,65.48 50.88,65.2 51.49,64.92 52.4,64.44 53.09,64.06 53.65,63.73 54.2,63.37 55.07,62.79 55.73,62.36 56.24,61.95 56.77,61.54 57.56,60.88 58.17,60.38 58.65,59.92 59.11,59.49 59.84,58.73 60.38,58.17 60.81,57.66 61.24,57.17 61.87,56.34 62.36,55.73 v62.74,55.19 63.09,54.63 63.65,53.77 64.06,53.09 64.39,52.53 64.69,51.94 65.15,51 65.48,50.29 65.99,49.07 66.34,48.11 66.6,47.37 66.8,46.74 66.98,46.1 67.23,45.09 67.41,44.32 67.67,43.05 67.82,42.01 67.92,41.22 67.97,40.59 68.02,39.93 68.07,38.89 68.07,37.44 68.05,36.8 67.97,35.74 67.92,34.98 67.84,34.31 67.74,33.68 67.56,32.64 67.28,31.24 v67.11,30.61 66.83,29.59 66.6,28.83 66.4,28.22 66.17,27.61 v65.79,26.62 65.48,25.91 v65.2,25.32 64.92,24.71 64.44,23.8 64.06,23.11 63.73,22.55 63.37,22 62.79,21.13 62.36,20.47 61.95,19.96 61.54,19.43 60.88,18.64 60.38,18.03 59.92,17.55 59.49,17.09 58.73,16.36 58.17,15.82 57.66,15.39 57.17,14.96 56.34,14.33 55.73,13.84 55.19,13.46 54.63,13.11 53.77,12.55 53.09,12.14 52.53,11.81 51.94,11.51 51,11.05 50.29,10.72 49.07,10.21 48.11,9.86 47.37,9.6 46.74,9.4 46.1,9.22 45.09,8.97 44.32,8.79 v43.69,8.66 43.05,8.53 42.01,8.38 41.22,8.28 40.59,8.23 39.93,8.18 38.89,8.13 37.44,8.13 v36.8,8.15 35.74,8.23 34.98,8.28 34.31,8.36 33.68,8.46 32.64,8.64 31.24,8.91 30.61,9.09 v29.59,9.37 28.83,9.6 28.22,9.8 27.61,10.03 26.62,10.41 25.91,10.72 25.32,11 24.71,11.28 23.8,11.76 23.11,12.14 22.55,12.47 22,12.83 21.13,13.41 20.47,13.84 v19.96,14.25 19.43,14.66 18.64,15.32 18.03,15.82 17.55,16.28 17.09,16.71 16.36,17.48 15.82,18.03 15.39,18.54 14.96,19.02 14.33,19.86 13.84,20.47 13.46,21.01 13.11,21.57 12.55,22.43 12.14,23.11 11.81,23.67 11.51,24.26 11.05,25.2 10.72,25.91 10.21,27.13 9.86,28.09 9.6,28.83 9.4,29.46 v9.22,30.1 8.97,31.11 8.79,31.88 v8.66,32.51 8.53,33.15 8.38,34.19 8.28,34.98 8.23,35.61 8.18,36.27 8.13,37.31 8.13,38.76 8.15,39.4 v8.23,40.46 8.28,41.22 8.36,41.88 8.46,42.52 8.64,43.56 8.91,44.96 9.09,45.59 9.37,46.61 9.6,47.37 9.8,47.98 10.03,48.59 10.41,49.58 10.72,50.29 v11,50.88 11.28,51.49 11.76,52.4 12.14,53.09 12.47,53.65 12.83,54.2 13.41,55.07 13.84,55.73 14.25,56.24 14.66,56.77 15.32,57.56 15.82,58.17 16.28,58.65 16.71,59.11 17.48,59.84 18.03,60.38 18.54,60.81 19.02,61.24 19.86,61.87 20.47,62.36 21.01,62.74 21.57,63.09 22.43,63.65 23.11,64.06 23.67,64.39 24.26,64.69 25.2,65.15 25.91,65.48 27.13,65.99 28.09,66.34 28.83,66.6 29.46,66.8 30.1,66.98 v31.11,67.23 31.88,67.41 33.15,67.67 34.19,67.82 34.98,67.92 35.61,67.97 36.27,68.02
  Bottom 0.152: v50.83,72.16 v48.59,66.17 | v52.4,72.59 v49.58,65.79 | v73.3,29.01 v67.11,30.61 | v72.59,23.8 v65.79,26.62 | v36.52,1.78 v36.8,8.15 | v27.48,2.29 v29.59,9.37 | v3.07,28.4 v9.22,30.1 | v0.86,41.02 v8.23,40.46 | v29.39,74.42 v31.11,67.23 | 68.58,59.23 v62.74,55.19 | 71.65,22.28 v65.2,25.32 | 45.01,1.65 v43.69,8.66 | 15.65,8.59 v19.96,14.25 | 1.65,31.19 v8.66,32.51 | 4.55,53.92 v11,50.88
Q06  (via drill 0.33)  (30 unrouted)
  Top 0.152: 37.34,67.31 38.73,67.31 39.37,67.28 40.39,67.21 41.15,67.16 41.78,67.08 42.42,66.98 43.43,66.83 44.17,66.67 44.81,66.52 45.41,66.37 46.41,66.12 47.12,65.89 47.73,65.68 48.34,65.46 49.28,65.08 49.99,64.8 50.57,64.52 v51.13,64.24 v52.05,63.78 52.7,63.4 53.26,63.07 53.8,62.74 54.63,62.18 55.27,61.72 56.29,60.96 57.07,60.3 57.66,59.82 58.12,59.38 59.28,58.22 59.82,57.66 60.22,57.17 60.63,56.67 61.27,55.88 61.72,55.27 62.1,54.74 62.46,54.23 63.02,53.37 63.4,52.7 v63.7,52.15 64.01,51.59 64.47,50.67 64.8,49.99 65.05,49.4 65.28,48.79 65.63,47.85 65.89,47.12 66.24,45.9 66.5,44.91 66.67,44.17 66.8,43.56 66.9,42.93 67.06,41.91 67.16,41.15 67.26,39.88 67.31,38.86 67.31,37.47 67.28,36.83 67.21,35.81 67.16,35.05 67.08,34.42 66.98,33.78 66.83,32.77 66.67,32.03 66.52,31.39 66.37,30.79 66.12,29.79 65.89,29.08 65.68,28.47 v65.46,27.86 65.08,26.92 64.8,26.21 64.52,25.63 v63.78,24.16 63.4,23.5 v63.07,22.94 62.74,22.4 62.18,21.57 61.72,20.93 60.96,19.91 60.3,19.13 59.82,18.54 59.38,18.09 58.22,16.92 57.66,16.38 57.17,15.98 56.67,15.57 55.88,14.94 55.27,14.48 54.74,14.1 54.23,13.74 53.37,13.18 52.7,12.8 51.59,12.19 50.67,11.73 49.99,11.4 49.4,11.15 48.79,10.92 47.85,10.57 47.12,10.31 45.9,9.96 44.91,9.7 44.17,9.53 43.56,9.4 42.93,9.3 41.91,9.14 41.15,9.04 v40.51,8.99 39.88,8.94 38.86,8.89 37.47,8.89 36.83,8.91 35.81,8.99 35.05,9.04 34.42,9.12 v33.78,9.22 32.77,9.37 32.03,9.53 31.39,9.68 30.79,9.83 29.79,10.08 29.08,10.31 28.47,10.52 27.86,10.74 v26.92,11.12 26.21,11.4 25.63,11.68 24.16,12.42 23.5,12.8 22.94,13.13 22.4,13.46 21.57,14.02 20.93,14.48 19.91,15.24 19.13,15.9 18.54,16.38 v18.09,16.82 16.92,17.98 16.38,18.54 15.98,19.02 15.57,19.53 14.94,20.32 14.48,20.93 14.1,21.46 13.74,21.97 13.18,22.84 12.8,23.5 12.19,24.61 11.73,25.53 11.4,26.21 11.15,26.8 10.92,27.41 10.57,28.35 10.31,29.08 9.96,30.3 9.7,31.29 9.53,32.03 9.4,32.64 v9.3,33.27 9.14,34.29 9.04,35.05 v8.99,35.69 8.94,36.32 8.89,37.34 8.89,38.73 8.91,39.37 8.99,40.39 9.04,41.15 9.12,41.78 9.22,42.42 v9.37,43.43 9.53,44.17 9.68,44.81 9.83,45.41 10.08,46.41 10.31,47.12 10.52,47.73 10.74,48.34 11.12,49.28 11.4,49.99 11.68,50.57 12.42,52.05 12.8,52.7 13.13,53.26 13.46,53.8 14.02,54.63 14.48,55.27 15.24,56.29 15.9,57.07 16.38,57.66 16.82,58.12 17.98,59.28 18.54,59.82 19.02,60.22 19.53,60.63 20.32,61.27 20.93,61.72 21.46,62.1 v21.97,62.46 22.84,63.02 23.5,63.4 24.61,64.01 25.53,64.47 26.21,64.8 26.8,65.05 27.41,65.28 28.35,65.63 29.08,65.89 30.3,66.24 31.29,66.5 32.03,66.67 32.64,66.8 33.27,66.9 v34.29,67.06 35.05,67.16 36.32,67.26
  Bottom 0.152: v54.33,70.64 v51.13,64.24 | v55.93,70.92 v52.05,63.78 | v72.16,25.38 v65.46,27.86 | v70.92,20.27 v63.78,24.16 | v32.72,2.13 v33.78,9.22 | v23.8,3.61 v26.92,11.12 | v2.23,32.11 v9.3,33.27 | v1.37,44.91 v9.37,43.43 | v18.03,68.43 v21.97,62.46 | v33.22,75.13 v34.29,67.06 | 70.61,55.93 v63.7,52.15 | 69.8,18.85 v63.07,22.94 | 41.17,1.14 v40.51,8.99 | 12.68,11.07 v18.09,16.82 | 1.14,35.03 v8.99,35.69
Q07  (via drill 0.33)  (30 unrouted)
  Top 0.152: 37.36,66.55 v38.71,66.55 39.34,66.52 40.34,66.47 41.07,66.4 41.68,66.32 42.32,66.24 43.28,66.06 44.02,65.94 44.63,65.79 45.21,65.63 46.18,65.38 46.89,65.15 48.06,64.75 49,64.39 49.68,64.08 50.24,63.83 50.8,63.55 51.66,63.09 v52.32,62.74 52.86,62.43 v53.39,62.1 v54.2,61.54 54.81,61.11 55.32,60.76 55.8,60.38 56.57,59.74 57.12,59.23 57.58,58.83 58.04,58.4 58.73,57.68 59.23,57.12 59.64,56.67 60.05,56.19 60.68,55.42 61.11,54.81 61.82,53.8 62.36,52.96 62.74,52.32 63.04,51.79 63.32,51.23 63.78,50.34 64.08,49.68 v64.34,49.1 64.57,48.51 64.92,47.6 65.15,46.89 65.33,46.3 65.51,45.7 65.76,44.73 65.94,44.02 66.04,43.41 66.17,42.8 66.29,41.81 66.4,41.07 66.45,40.46 66.5,39.83 66.55,38.84 66.55,37.49 66.52,36.85 66.47,35.87 66.4,35.13 66.32,34.52 66.24,33.88 66.06,32.92 65.94,32.18 65.79,31.57 65.63,30.99 65.38,30.02 65.15,29.31 64.75,28.14 64.39,27.2 64.08,26.52 63.83,25.96 v63.55,25.4 63.09,24.54 62.74,23.88 62.43,23.34 62.1,22.81 v61.54,22 61.11,21.39 v60.76,20.88 60.38,20.4 59.74,19.63 59.23,19.07 58.83,18.62 58.4,18.16 57.68,17.48 57.12,16.97 56.67,16.56 56.19,16.15 55.42,15.52 54.81,15.09 53.8,14.38 52.96,13.84 52.32,13.46 51.79,13.16 51.23,12.88 50.34,12.42 49.68,12.12 49.1,11.86 48.51,11.63 47.6,11.28 46.89,11.05 46.3,10.87 45.7,10.69 44.73,10.44 44.02,10.26 43.41,10.16 42.8,10.03 41.81,9.91 41.07,9.8 40.46,9.75 39.83,9.7 38.84,9.65 v37.49,9.65 36.85,9.68 35.87,9.73 35.13,9.8 34.52,9.88 33.88,9.96 32.92,10.13 32.18,10.26 31.57,10.41 v30.99,10.57 30.02,10.82 29.31,11.05 28.14,11.46 27.2,11.81 26.52,12.12 25.96,12.37 25.4,12.65 v24.54,13.11 23.88,13.46 23.34,13.77 22.81,14.1 22,14.66 21.39,15.09 20.88,15.44 20.4,15.82 19.63,16.46 19.07,16.97 18.62,17.37 18.16,17.8 17.48,18.52 16.97,19.07 v16.56,19.53 16.15,20.02 15.52,20.78 15.09,21.39 14.38,22.4 13.84,23.24 13.46,23.88 13.16,24.41 12.88,24.97 12.42,25.86 12.12,26.52 11.86,27.1 11.63,27.69 11.28,28.6 11.05,29.31 10.87,29.9 10.69,30.5 10.44,31.47 10.26,32.18 10.16,32.79 10.03,33.4 9.91,34.39 9.8,35.13 9.75,35.74 v9.7,36.37 9.65,37.36 9.65,38.71 9.68,39.34 9.73,40.34 9.8,41.07 9.88,41.68 9.96,42.32 10.13,43.28 10.26,44.02 10.41,44.63 10.57,45.21 v10.82,46.18 11.05,46.89 11.46,48.06 11.81,49 12.12,49.68 12.37,50.24 12.65,50.8 13.11,51.66 13.46,52.32 13.77,52.86 14.1,53.39 14.66,54.2 15.09,54.81 15.44,55.32 15.82,55.8 16.46,56.57 16.97,57.12 17.37,57.58 17.8,58.04 18.52,58.73 19.07,59.23 19.53,59.64 20.02,60.05 20.78,60.68 21.39,61.11 22.4,61.82 23.24,62.36 23.88,62.74 24.41,63.04 v24.97,63.32 25.86,63.78 26.52,64.08 27.1,64.34 27.69,64.57 28.6,64.92 29.31,65.15 29.9,65.33 30.5,65.51 31.47,65.76 32.18,65.94 32.79,66.04 33.4,66.17 34.39,66.29 35.13,66.4 35.74,66.45 36.37,66.5
  Bottom 0.152: v57.63,68.76 v53.39,62.1 | v59.26,68.89 v54.2,61.54 | v70.64,21.87 v63.55,25.4 | v68.89,16.94 v61.54,22 | v29.01,2.9 v30.99,10.57 | v20.27,5.28 v24.54,13.11 | v1.8,35.89 v9.7,36.37 | v2.29,48.72 v10.82,46.18 | v21.31,70.36 v24.97,63.32 | 38.91,75.18 v38.71,66.55 | 56.29,69.6 v52.32,62.74 | 72.31,52.45 v64.34,49.1 | 67.61,15.65 v60.76,20.88 | 37.29,1.02 v37.49,9.65 | 10.01,13.89 v16.56,19.53
Q08  (via drill 0.33)  (30 unrouted)
  Top 0.152: 37.36,65.79 38.71,65.79 39.32,65.76 40.28,65.71 41,65.63 v41.6,65.56 42.19,65.48 43.16,65.33 43.87,65.18 44.45,65.05 45.03,64.9 45.97,64.64 46.66,64.44 47.22,64.24 47.8,64.03 48.69,63.68 49.35,63.4 49.91,63.14 50.44,62.87 51.31,62.43 51.94,62.08 52.45,61.77 52.98,61.44 53.77,60.91 v54.38,60.5 54.86,60.15 v55.35,59.77 v56.08,59.16 56.62,58.67 57.07,58.27 58.19,57.15 58.67,56.62 59.08,56.19 59.46,55.7 60.07,54.97 60.5,54.38 60.86,53.87 61.19,53.39 61.7,52.58 62.08,51.94 62.38,51.41 62.66,50.88 63.09,50.01 63.4,49.35 63.63,48.82 63.86,48.23 64.19,47.35 64.44,46.66 v64.62,46.08 64.77,45.49 65.02,44.55 65.18,43.87 65.3,43.26 65.41,42.67 65.56,41.71 65.63,41 65.68,40.39 65.73,39.8 65.79,38.84 v65.79,38.1 65.79,37.49 65.76,36.88 65.71,35.92 65.63,35.2 65.56,34.59 65.48,34.01 65.33,33.05 65.18,32.33 65.05,31.75 64.9,31.17 64.64,30.23 64.44,29.54 64.24,28.98 64.03,28.4 63.68,27.51 63.4,26.85 63.14,26.29 62.87,25.76 62.43,24.89 62.08,24.26 61.77,23.75 v61.44,23.22 60.91,22.43 60.5,21.82 60.15,21.34 59.77,20.85 v59.16,20.12 58.67,19.58 v58.27,19.13 57.15,18.01 56.62,17.53 56.19,17.12 55.7,16.74 54.97,16.13 54.38,15.7 53.87,15.34 53.39,15.01 52.58,14.5 51.94,14.12 51.41,13.82 50.88,13.54 50.01,13.11 49.35,12.8 48.82,12.57 48.23,12.34 47.35,12.01 46.66,11.76 46.08,11.58 45.49,11.43 44.55,11.18 43.87,11.02 43.26,10.9 42.67,10.79 41.71,10.64 41,10.57 40.39,10.52 39.8,10.46 38.84,10.41 37.49,10.41 36.88,10.44 35.92,10.49 35.2,10.57 v34.59,10.64 34.01,10.72 33.05,10.87 32.33,11.02 31.75,11.15 31.17,11.3 30.23,11.56 29.54,11.76 28.98,11.96 v28.4,12.17 27.51,12.52 26.85,12.8 26.29,13.06 25.76,13.34 24.89,13.77 24.26,14.12 23.75,14.43 23.22,14.76 v22.43,15.29 21.82,15.7 21.34,16.05 20.85,16.43 20.12,17.04 19.58,17.53 19.13,17.93 18.01,19.05 17.53,19.58 17.12,20.02 16.74,20.5 16.13,21.23 15.7,21.82 15.34,22.33 15.01,22.81 14.5,23.62 14.12,24.26 13.82,24.79 13.54,25.32 13.11,26.19 12.8,26.85 12.57,27.38 12.34,27.96 12.01,28.85 11.76,29.54 11.58,30.12 11.43,30.71 11.18,31.65 11.02,32.33 10.9,32.94 10.79,33.53 10.64,34.49 10.57,35.2 10.52,35.81 10.46,36.4 10.41,37.36 10.41,38.71 v10.44,39.32 10.49,40.28 10.57,41 10.64,41.6 10.72,42.19 10.87,43.16 11.02,43.87 11.15,44.45 11.3,45.03 11.56,45.97 11.76,46.66 11.96,47.22 12.17,47.8 v12.52,48.69 12.8,49.35 13.06,49.91 13.34,50.44 13.77,51.31 14.12,51.94 14.43,52.45 14.76,52.98 15.29,53.77 15.7,54.38 16.05,54.86 16.43,55.35 17.04,56.08 17.53,56.62 17.93,57.07 19.05,58.19 19.58,58.67 20.02,59.08 20.5,59.46 21.23,60.07 21.82,60.5 22.33,60.86 22.81,61.19 23.62,61.7 24.26,62.08 24.79,62.38 25.32,62.66 26.19,63.09 26.85,63.4 27.38,63.63 v27.96,63.86 28.85,64.19 29.54,64.44 30.12,64.62 30.71,64.77 31.65,65.02 32.33,65.18 32.94,65.3 33.53,65.41 34.49,65.56 35.2,65.63 35.81,65.68 36.4,65.73
  Bottom 0.152: v60.73,66.55 v55.35,59.77 | v62.36,66.5 v56.08,59.16 | v68.76,18.57 v61.44,23.22 | v66.5,13.84 v59.16,20.12 | v25.38,4.04 v28.4,12.17 | v16.94,7.32 v22.43,15.29 | v1.78,39.67 v10.44,39.32 | v3.61,52.4 v12.52,48.69 | v24.77,71.93 v27.96,63.86 | 42.77,74.91 v41.6,65.56 | 59.46,67.51 v54.38,60.5 | 73.61,48.79 v64.62,46.08 | 74.45,38.1 v65.79,38.1 | 65.13,12.68 v58.27,19.13 | 33.43,1.29 v34.59,10.64
Q09  (via drill 0.33)  (30 unrouted)
  Top 0.152: 37.39,65.02 38.68,65.02 39.27,65 40.21,64.95 40.92,64.87 41.5,64.82 42.09,64.72 43,64.57 43.69,64.44 v44.27,64.31 44.83,64.16 45.74,63.91 46.43,63.7 46.97,63.52 47.52,63.32 48.41,62.97 49.05,62.69 49.58,62.46 50.11,62.2 50.95,61.77 51.56,61.42 52.58,60.81 53.34,60.3 53.92,59.89 54.41,59.54 54.86,59.18 v56.11,58.12 v56.97,57.3 v57.63,56.64 58.12,56.11 58.5,55.68 58.88,55.22 59.46,54.48 59.89,53.92 60.55,52.96 61.06,52.17 61.42,51.56 61.7,51.05 61.98,50.52 62.41,49.68 62.69,49.05 62.94,48.51 63.14,47.95 63.48,47.09 63.7,46.43 63.88,45.85 64.03,45.29 64.29,44.37 64.44,43.69 v64.54,43.13 64.64,42.55 64.8,41.6 64.87,40.92 64.97,39.75 65.02,38.81 65.02,37.52 65,36.93 64.95,35.99 v64.87,35.28 64.82,34.7 64.72,34.11 64.57,33.2 64.44,32.51 64.31,31.93 64.16,31.37 63.91,30.45 63.7,29.77 63.52,29.23 63.32,28.68 62.97,27.79 62.69,27.15 62.46,26.62 62.2,26.09 61.77,25.25 61.42,24.64 60.81,23.62 60.3,22.86 59.89,22.28 59.54,21.79 v59.18,21.34 58.12,20.09 57.3,19.23 v56.64,18.57 56.11,18.09 v55.68,17.7 55.22,17.32 54.48,16.74 v53.92,16.31 52.96,15.65 52.17,15.14 51.56,14.78 51.05,14.5 50.52,14.22 49.68,13.79 49.05,13.51 48.51,13.26 47.95,13.06 47.09,12.72 46.43,12.5 45.85,12.32 45.29,12.17 44.37,11.91 43.69,11.76 43.13,11.66 42.55,11.56 41.6,11.4 40.92,11.33 39.75,11.23 38.81,11.18 37.52,11.18 36.93,11.2 35.99,11.25 35.28,11.33 34.7,11.38 34.11,11.48 33.2,11.63 32.51,11.76 31.93,11.89 31.37,12.04 30.45,12.29 29.77,12.5 29.23,12.68 28.68,12.88 27.79,13.23 27.15,13.51 26.62,13.74 v26.09,13.99 25.25,14.43 24.64,14.78 23.62,15.39 22.86,15.9 22.28,16.31 21.79,16.66 21.34,17.02 v20.62,17.63 20.09,18.09 19.23,18.9 18.57,19.56 18.09,20.09 17.7,20.52 17.32,20.98 16.74,21.72 16.31,22.28 15.65,23.24 15.14,24.03 14.78,24.64 14.5,25.15 14.22,25.68 13.79,26.52 13.51,27.15 13.26,27.69 13.06,28.25 12.72,29.11 12.5,29.77 12.32,30.35 12.17,30.91 11.91,31.83 11.76,32.51 11.66,33.07 11.56,33.66 11.4,34.59 11.33,35.28 11.23,36.45 11.18,37.39 11.18,38.68 11.2,39.27 11.25,40.21 11.33,40.92 11.38,41.5 v11.48,42.09 11.63,43 11.76,43.69 11.89,44.27 12.04,44.83 12.29,45.74 12.5,46.43 12.68,46.97 12.88,47.52 13.23,48.41 13.51,49.05 13.74,49.58 13.99,50.11 v14.43,50.95 14.78,51.56 15.39,52.58 15.9,53.34 16.31,53.92 16.66,54.41 17.02,54.86 18.09,56.11 18.9,56.97 19.56,57.63 20.09,58.12 20.52,58.5 20.98,58.88 21.72,59.46 22.28,59.89 23.24,60.55 24.03,61.06 24.64,61.42 25.15,61.7 25.68,61.98 26.52,62.41 27.15,62.69 27.69,62.94 28.25,63.14 29.11,63.48 29.77,63.7 30.35,63.88 v30.91,64.03 31.83,64.29 32.51,64.44 33.07,64.54 33.66,64.64 34.59,64.8 35.28,64.87 36.45,64.97
  Bottom 0.152: v63.58,64.03 v56.97,57.3 | v65.18,63.8 v57.63,56.64 | v66.55,15.47 v59.18,21.34 | v63.8,11.02 v56.64,18.57 | v21.87,5.56 v26.09,13.99 | v13.84,9.7 v20.62,17.63 | v2.13,43.48 v11.48,42.09 | v5.28,55.93 v14.43,50.95 | v28.4,73.13 v30.91,64.03 | 46.61,74.19 v44.27,64.31 | 62.43,65.13 v56.11,58.12 | 74.55,45.01 v64.54,43.13 | 74.24,34.29 v64.87,35.28 | 62.31,10.01 v55.68,17.7 | 59.46,8.69 v53.92,16.31
Q10  (via drill 0.33)  (30 unrouted)
  Top 0.152: 37.41,64.26 38.66,64.26 39.24,64.24 40.16,64.19 40.84,64.11 41.4,64.06 41.96,63.98 42.88,63.83 43.54,63.68 44.09,63.58 44.65,63.42 45.54,63.2 46.18,62.99 v46.74,62.79 47.27,62.61 48.11,62.28 48.74,62 49.25,61.77 49.78,61.52 50.57,61.09 51.18,60.76 51.66,60.48 52.15,60.17 52.91,59.66 53.47,59.26 53.92,58.93 54.38,58.57 55.09,57.99 55.6,57.53 56.03,57.15 56.44,56.77 57.07,56.11 v57.53,55.6 v58.29,54.74 v58.85,54.03 59.26,53.47 59.59,53.01 59.92,52.53 60.4,51.77 60.76,51.18 61.04,50.67 61.32,50.19 61.72,49.35 62,48.74 62.23,48.21 62.43,47.68 62.76,46.84 62.99,46.18 63.14,45.64 63.32,45.09 63.55,44.2 63.68,43.54 63.8,42.98 63.91,42.42 64.03,41.5 64.11,40.84 v64.16,40.26 64.21,39.7 64.26,38.79 64.26,37.54 64.24,36.96 64.19,36.04 64.11,35.36 64.06,34.8 63.98,34.24 63.83,33.33 v63.68,32.66 63.58,32.11 63.42,31.55 63.2,30.66 62.99,30.02 62.79,29.46 62.61,28.93 62.28,28.09 62,27.46 61.77,26.95 61.52,26.42 61.09,25.63 60.76,25.02 60.48,24.54 60.17,24.05 59.66,23.29 59.26,22.73 58.93,22.28 58.57,21.82 57.99,21.11 57.53,20.6 57.15,20.17 v56.77,19.76 56.11,19.13 55.6,18.67 54.74,17.91 v54.03,17.35 53.47,16.94 53.01,16.61 52.53,16.28 51.77,15.8 v51.18,15.44 50.67,15.16 50.19,14.88 49.35,14.48 48.74,14.2 48.21,13.97 47.68,13.77 46.84,13.44 46.18,13.21 45.64,13.06 45.09,12.88 44.2,12.65 43.54,12.52 42.98,12.39 42.42,12.29 41.5,12.17 40.84,12.09 40.26,12.04 39.7,11.99 38.79,11.94 37.54,11.94 36.96,11.96 36.04,12.01 35.36,12.09 34.8,12.14 34.24,12.22 33.33,12.37 v32.66,12.52 32.11,12.62 31.55,12.78 30.66,13.01 30.02,13.21 29.46,13.41 28.93,13.59 28.09,13.92 27.46,14.2 26.95,14.43 26.42,14.68 25.63,15.11 25.02,15.44 24.54,15.72 v24.05,16.03 23.29,16.54 22.73,16.94 22.28,17.27 21.82,17.63 21.11,18.21 20.6,18.67 20.17,19.05 19.76,19.43 v19.13,20.09 18.67,20.6 17.91,21.46 17.35,22.17 16.94,22.73 16.61,23.19 16.28,23.67 15.8,24.43 15.44,25.02 15.16,25.53 14.88,26.01 14.48,26.85 14.2,27.46 13.97,27.99 13.77,28.52 13.44,29.36 13.21,30.02 13.06,30.56 12.88,31.11 12.65,32 12.52,32.66 12.39,33.22 12.29,33.78 12.17,34.7 12.09,35.36 12.04,35.94 11.99,36.5 11.94,37.41 11.94,38.66 11.96,39.24 12.01,40.16 12.09,40.84 12.14,41.4 12.22,41.96 12.37,42.88 12.52,43.54 12.62,44.09 v12.78,44.65 13.01,45.54 13.21,46.18 13.41,46.74 13.59,47.27 13.92,48.11 14.2,48.74 14.43,49.25 14.68,49.78 15.11,50.57 15.44,51.18 15.72,51.66 16.03,52.15 v16.54,52.91 16.94,53.47 17.27,53.92 17.63,54.38 18.21,55.09 18.67,55.6 19.05,56.03 19.43,56.44 20.09,57.07 20.6,57.53 21.46,58.29 22.17,58.85 22.73,59.26 23.19,59.59 23.67,59.92 24.43,60.4 25.02,60.76 25.53,61.04 26.01,61.32 26.85,61.72 27.46,62 27.99,62.23 28.52,62.43 29.36,62.76 30.02,62.99 30.56,63.14 31.11,63.32 32,63.55 32.66,63.68 33.22,63.8 v33.78,63.91 34.7,64.03 35.36,64.11 35.94,64.16 36.5,64.21
  Bottom 0.152: v66.14,61.21 v58.29,54.74 | v67.72,60.83 v58.85,54.03 | v64.03,12.62 v56.77,19.76 | v60.83,8.48 v54.03,17.35 | v18.57,7.44 v24.05,16.03 | v11.02,12.39 v19.13,20.09 | v2.9,47.19 v12.78,44.65 | v7.32,59.26 v16.54,52.91 | v32.11,73.97 v33.78,63.91 | 50.32,73.13 v46.74,62.79 | 65.13,62.43 v57.53,55.6 | 75.06,41.17 v64.16,40.26 | 73.66,30.53 v63.68,32.66 | 56.29,6.6 v51.18,15.44 | 30.53,2.54 v32.66,12.52
Q11  (via drill 0.33)  (30 unrouted)
  Top 0.152: 37.44,63.5 38.66,63.5 39.22,63.48 40.08,63.42 40.77,63.37 41.3,63.3 41.86,63.22 42.72,63.07 43.38,62.94 44.45,62.69 45.31,62.46 45.95,62.26 46.48,62.08 46.99,61.9 47.83,61.57 48.44,61.32 v48.95,61.06 49.43,60.83 50.22,60.43 50.8,60.1 51.28,59.82 51.74,59.51 52.48,59.03 53.03,58.65 53.47,58.32 53.92,57.99 54.59,57.4 55.09,56.97 55.91,56.21 56.52,55.58 56.97,55.09 57.35,54.69 57.71,54.25 58.24,53.57 v58.65,53.03 58.98,52.58 v59.28,52.12 v59.77,51.36 60.1,50.8 60.38,50.32 60.63,49.84 61.04,49.05 61.32,48.44 61.72,47.42 62.05,46.58 62.26,45.95 62.43,45.41 62.59,44.88 62.79,44.02 62.94,43.38 63.04,42.85 63.14,42.29 63.27,41.43 63.37,40.77 63.42,40.21 63.45,39.65 63.5,38.76 63.5,37.54 63.48,36.98 63.42,36.12 63.37,35.43 63.3,34.9 63.22,34.34 63.07,33.48 62.94,32.82 62.69,31.75 62.46,30.89 v62.26,30.25 62.08,29.72 61.9,29.21 61.57,28.37 61.32,27.76 61.06,27.25 60.83,26.77 60.43,25.98 60.1,25.4 59.82,24.92 59.51,24.46 59.03,23.72 58.65,23.16 58.32,22.73 57.99,22.28 57.4,21.61 56.97,21.11 56.21,20.3 55.58,19.68 55.09,19.23 54.69,18.85 v54.25,18.49 53.57,17.96 53.03,17.55 52.58,17.22 52.12,16.92 v51.36,16.43 50.8,16.1 50.32,15.82 49.84,15.57 49.05,15.16 v48.44,14.88 47.42,14.48 46.58,14.15 45.95,13.95 45.41,13.77 44.88,13.61 44.02,13.41 43.38,13.26 42.85,13.16 42.29,13.06 41.43,12.93 40.77,12.83 40.21,12.78 39.65,12.75 38.76,12.7 37.54,12.7 36.98,12.72 36.12,12.78 35.43,12.83 34.9,12.9 34.34,12.98 33.48,13.13 32.82,13.26 31.75,13.51 30.89,13.74 v30.25,13.95 29.72,14.12 29.21,14.3 28.37,14.63 27.76,14.88 27.25,15.14 26.77,15.37 25.98,15.77 25.4,16.1 24.92,16.38 24.46,16.69 23.72,17.17 23.16,17.55 22.73,17.88 v22.28,18.21 21.61,18.8 21.11,19.23 20.3,19.99 19.68,20.62 19.23,21.11 18.85,21.51 18.49,21.95 v17.96,22.63 v17.55,23.16 17.22,23.62 16.92,24.08 16.43,24.84 16.1,25.4 15.82,25.88 15.57,26.36 15.16,27.15 14.88,27.76 14.48,28.78 14.15,29.62 13.95,30.25 13.77,30.79 13.61,31.32 13.41,32.18 13.26,32.82 13.16,33.35 13.06,33.91 12.93,34.77 12.83,35.43 12.78,35.99 12.75,36.55 12.7,37.44 12.7,38.66 12.72,39.22 12.78,40.08 12.83,40.77 12.9,41.3 12.98,41.86 13.13,42.72 13.26,43.38 13.51,44.45 13.74,45.31 13.95,45.95 14.12,46.48 v14.3,46.99 14.63,47.83 14.88,48.44 15.14,48.95 15.37,49.43 15.77,50.22 16.1,50.8 16.38,51.28 16.69,51.74 17.17,52.48 17.55,53.03 17.88,53.47 18.21,53.92 v18.8,54.59 19.23,55.09 19.99,55.91 20.62,56.52 21.11,56.97 21.51,57.35 21.95,57.71 22.63,58.24 23.16,58.65 23.62,58.98 24.08,59.28 24.84,59.77 25.4,60.1 25.88,60.38 26.36,60.63 27.15,61.04 27.76,61.32 28.78,61.72 29.62,62.05 30.25,62.26 30.79,62.43 31.32,62.59 32.18,62.79 32.82,62.94 33.35,63.04 33.91,63.14 34.77,63.27 35.43,63.37 35.99,63.42 v36.55,63.45
  Bottom 0.152: v68.43,58.17 v59.28,52.12 | v69.95,57.61 v59.77,51.36 | v61.21,10.06 v54.25,18.49 | v57.61,6.25 v51.36,16.43 | v15.47,9.65 v22.28,18.21 | v8.48,15.37 v17.96,22.63 | v4.04,50.83 v14.3,46.99 | v9.7,62.36 v18.8,54.59 | v35.89,74.4 v36.55,63.45 | 53.92,71.65 v48.95,61.06 | 67.51,59.46 v58.65,53.03 | 72.67,26.87 v62.26,30.25 | 52.88,4.88 v48.44,14.88 | 26.87,3.53 v30.25,13.95 | 8.69,16.74 v17.55,23.16
Q12  (via drill 0.33)  (30 unrouted)